# EAGLE design power-distro-board (EAGLE 9.2.0)
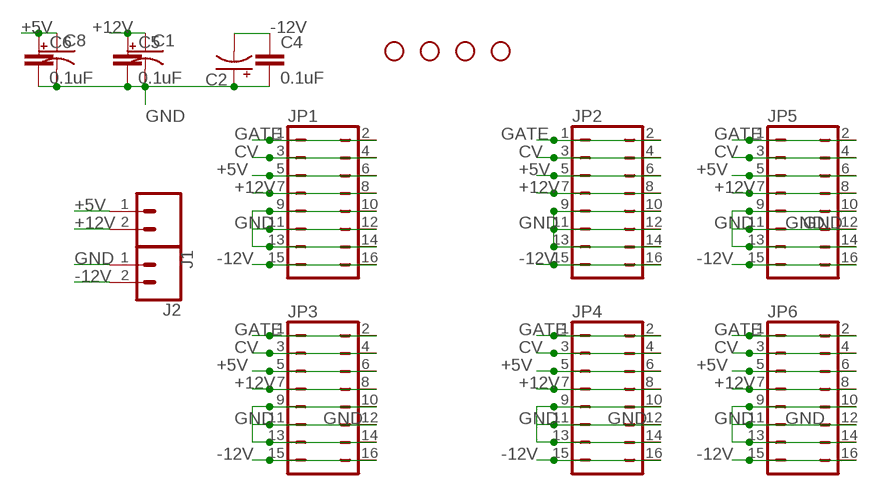
[diagram p0: schematic, sheet 1]

## Parts
C1  CPOL-USE2.5-6  [E2,5-6]
C2  CPOL-USE2.5-6  [E2,5-6]
C4  0.1uF  0.1UF-KIT-EZ-50V-20%  [CAP-PTH-SMALL-KIT]
C5  0.1uF  0.1UF-KIT-EZ-50V-20%  [CAP-PTH-SMALL-KIT]
C6  0.1uF  0.1UF-KIT-EZ-50V-20%  [CAP-PTH-SMALL-KIT]
C8  CPOL-USE2.5-6  [E2,5-6]
H1  STAND-OFF  [STAND-OFF]
H2  STAND-OFF  [STAND-OFF]
H3  STAND-OFF  [STAND-OFF]
H4  STAND-OFF  [STAND-OFF]
J1  CONN_023.5MM  [SCREWTERMINAL-3.5MM-2]
J2  CONN_023.5MM  [SCREWTERMINAL-3.5MM-2]
JP1  JP8Q  [JP8Q]
JP2  JP8Q  [JP8Q]
JP3  JP8Q  [JP8Q]
JP4  JP8Q  [JP8Q]
JP5  JP8Q  [JP8Q]
JP6  JP8Q  [JP8Q]

## Nets
+5V: C6.1 C8.+ J1.1 JP1.5 JP1.6 JP2.5 JP2.6 JP3.5 JP3.6 JP4.5 JP4.6 JP5.5 JP5.6 JP6.5 JP6.6
+12V: C1.+ C5.1 J1.2 JP1.7 JP1.8 JP2.7 JP2.8 JP3.7 JP3.8 JP4.7 JP4.8 JP5.7 JP5.8 JP6.7 JP6.8
-12V: C2.- C4.1 J2.2 JP1.15 JP1.16 JP2.15 JP2.16 JP3.15 JP3.16 JP4.15 JP4.16 JP5.15 JP5.16 JP6.15 JP6.16
CV: JP1.3 JP1.4 JP2.3 JP2.4 JP3.3 JP3.4 JP4.3 JP4.4 JP5.3 JP5.4 JP6.3 JP6.4
GATE: JP1.1 JP1.2 JP2.1 JP2.2 JP3.1 JP3.2 JP4.1 JP4.2 JP5.1 JP5.2 JP6.1 JP6.2
GND: C1.- C2.+ C4.2 C5.2 C6.2 C8.- J2.1 JP1.9 JP1.10 JP1.11 JP1.12 JP1.13 JP1.14 JP2.9 JP2.10 JP2.11 JP2.12 JP2.13 JP2.14 JP3.9 JP3.10 JP3.11 JP3.12 JP3.13 JP3.14 JP4.9 JP4.10 JP4.11 JP4.12 JP4.13 JP4.14 JP5.9 JP5.10 JP5.11 JP5.12 JP5.13 JP5.14 JP6.9 JP6.10 JP6.11 JP6.12 JP6.13 JP6.14

## Library data of the parts
C1 C2 C8 = rcl:CPOL-US: POLARIZED CAPACITOR, American symbol; SPICEPREFIX: C
C4-C6 = SparkFun-Capacitors:0.1UF: 0.1µF ceramic capacitors A capacitor is a passive two-terminal electrical component used to store electrical energy temporarily in an electric field.; PROD_ID: CAP-08370
H1-H4 = SparkFun-Hardware:STAND-OFF: Stand Off Drill holes for mechanically mounting via screws, standoffs, etc. Note: Use the keepout ring to avoid running the screw head into surrounding components. Variant Overviews STAND-OFF - Mechanical footprint for a #4 phillips button head screw. STAND-OFF-TIGHT - Mechanical footprint for a #4 phillips button head screw, Example SparkFun Products Screw - Phillips Head (1/4", 4-40, 10 pack) <https://www.sparkfun.com/products/10453> (PRT-10453) Screw - Phillips Head (1/2", 4-40, 10 pack) <https://www.sparkfun.com/products/10452> (PRT-10452) Screw - Phillips Head (3/4", 4-40, 10 pack) <https://www.sparkfun.com/products/10451> (PRT-10451) Screw - Phillips Head (1", 4-40, 10 pack) <https://www.sparkfun.com/products/10450> (PRT-10450)
J1 J2 = SparkFun-Connectors:CONN_02: Multi connection point. Often used as Generic Header-pin footprint for 0.1 inch spaced/style header connections On any of the 0.1 inch spaced packages, you can populate with these: Break Away Headers - Straight <https://www.sparkfun.com/products/116> (PRT-00116) Break Away Male Headers - Right Angle <https://www.sparkfun.com/products/553> (PRT-00553) Female Headers <https://www.sparkfun.com/products/115> (PRT-00115) Break Away Headers - Machine Pin <https://www.sparkfun.com/products/117> (PRT-00117) Break Away Female Headers - Swiss Machine Pin <https://www.sparkfun.com/products/743> (PRT-00743) For SCREWTERMINALS and SPRING TERMINALS visit here: Screw Terimnals on SparkFun.com <https://www.sparkfun.com/search/results?term=Screw+Terminals> (5mm/3.5mm/2.54mm spacing) This device is also useful as a general connection point to wire up your design to another part of your project. Our various solder wires solder well into these plated through hole pads. Hook-Up Wire - Assortment (Stranded, 22 AWG) <https://www.sparkfun.com/products/11375> (PRT-11375) Hook-Up Wire - Assortment (Solid Core, 22 AWG) <https://www.sparkfun.com/products/11367> (PRT-11367) View the entire wire category on our website here <https://www.sparkfun.com/categories/141> Special notes: Molex polarized connector foot print use with: PRT-08233 with associated crimp pins and housings. 2.54_SCREWTERM for use with PRT-10571. 3.5mm Screw Terminal footprints for PRT-08084 5mm Screw Terminal footprints for use with PRT-08432; PROD_ID: CONN-08399
JP1-JP6 = jumper:JP8Q: JUMPER

## Board
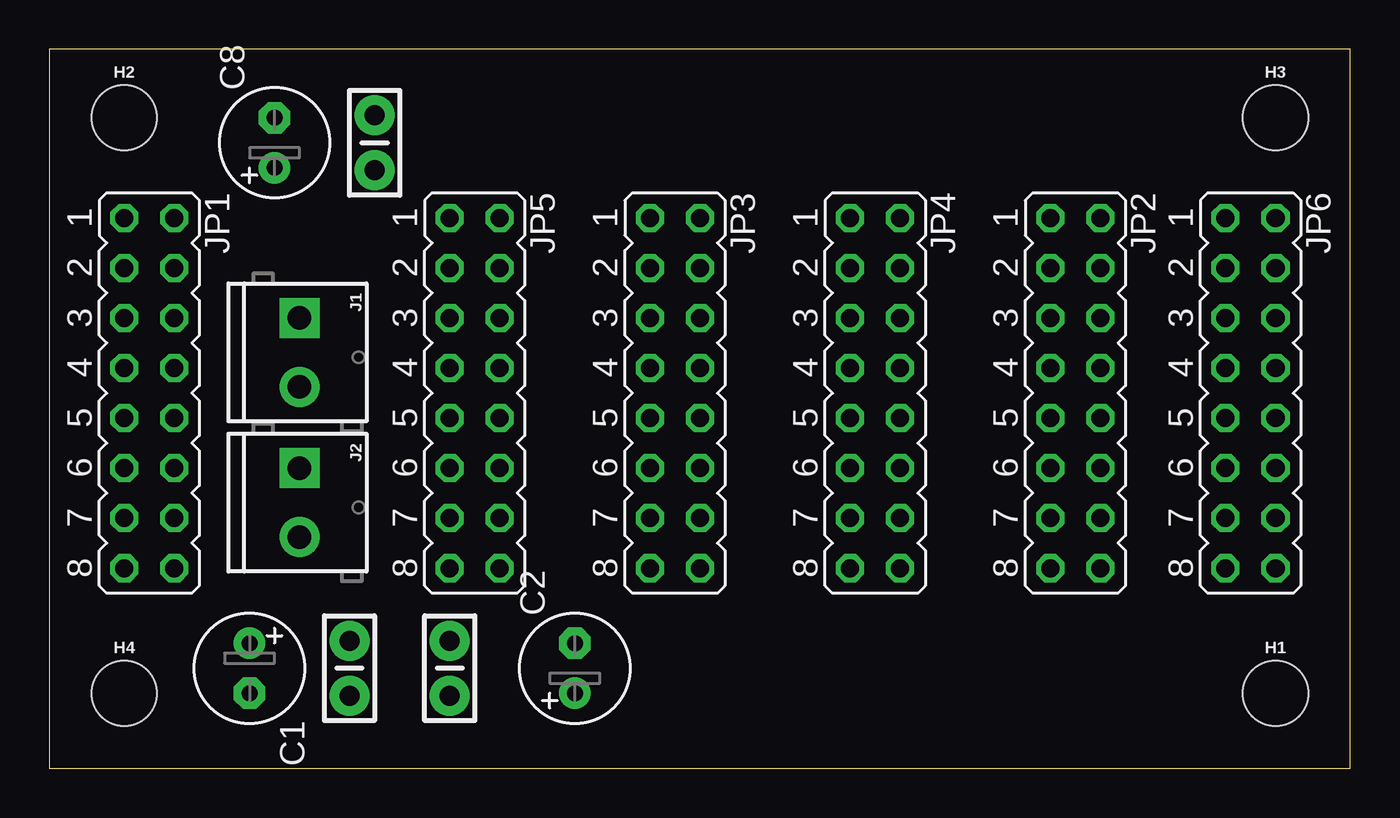
[diagram p1: board, top side]
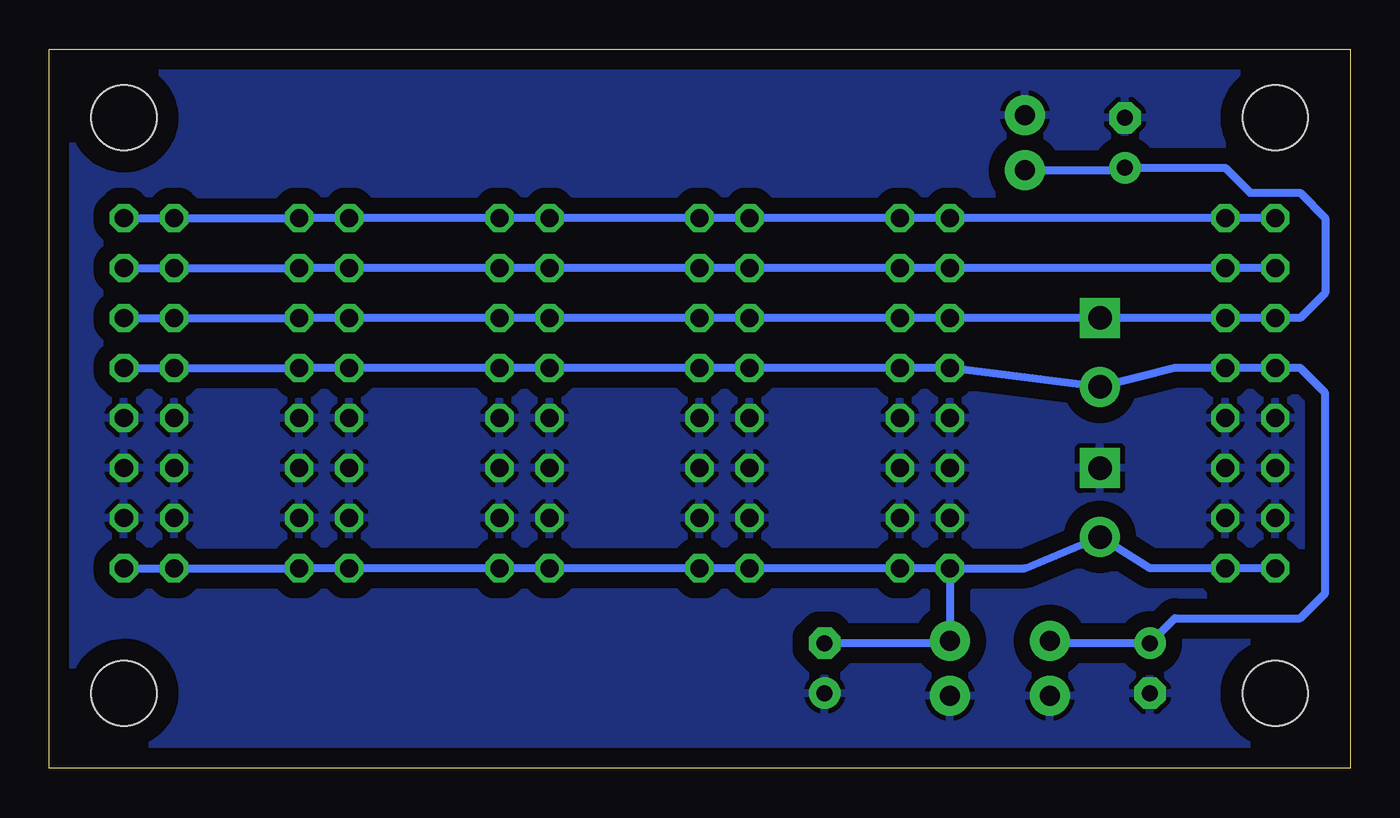
[diagram p2: board, bottom side, seen from below]

Size 66.02 x 36.5 mm. Coordinates in mm from the lower left corner, seen from the top.
Outline: 0,0 66.02,0 66.02,36.5 0,36.5 0,0
Copper layers (1*16): Top 0.035mm / dielectric 1.5mm / Bottom 0.035mm
Design rules "default": minimum track width 6mil, minimum drill 0.35mm, track to track 6mil, track to pad 6mil, pad to pad 6mil, via to via 6mil, smd to smd 6mil, copper to edge 40mil, drill to drill 6mil, minimum pad ring 10mil, minimum via ring 8mil, stop-mask expansion 4mil, vias tented up to drill 0mil, thermal gap 10mil

### Footprints (pad centres in the part's own frame; a part is rotated, then mirrored left to right if it is on the bottom)
E2,5-6 = drill 0.813 pad 1.6: + -1.27,0 | drill 0.813 pad 1.6 octagon: - 1.27,0
CAP-PTH-SMALL-KIT = drill 1.016 pad 2.032: 1 -1.397,0; 2 1.397,0
STAND-OFF = hole 3.302: 0,0
SCREWTERMINAL-3.5MM-2 = drill 1.2 pad 2.032 square: 1 0,0 | drill 1.2 pad 2.032: 2 3.5,0
JP8Q = drill 0.914 octagon: 1 -8.89,-1.27; 2 -8.89,1.27; 3 -6.35,-1.27; 4 -6.35,1.27; 5 -3.81,-1.27; 6 -3.81,1.27; 7 -1.27,-1.27; 8 -1.27,1.27; 9 1.27,-1.27; 10 1.27,1.27; 11 3.81,-1.27; 12 3.81,1.27; 13 6.35,-1.27; 14 6.35,1.27; 15 8.89,-1.27; 16 8.89,1.27

### Placement (x,y rotation side)
C1  10.16,5.08 270 top
C2  26.67,5.08 90 top
C4  20.32,5.08 270 top
C5  15.24,5.08 270 top
C6  16.51,31.75 90 top
C8  11.43,31.75 90 top
H1  62.23,3.81 0 top
H2  3.81,33.02 0 top
H3  62.23,33.02 0 top
H4  3.81,3.81 0 top
J1  12.7,22.86 270 top
J2  12.7,15.24 270 top
JP1  5.08,19.05 270 top
JP2  52.07,19.05 270 top
JP3  31.75,19.05 270 top
JP4  41.91,19.05 270 top
JP5  21.59,19.05 270 top
JP6  60.96,19.05 270 top

### Tracks (layer width: path | path; a pad name or v marks a point on that pad's centre or on a via)
+5V
  Bottom 0.406: JP6.6 JP6.5 JP2.6 JP2.5 JP4.6 JP4.5 JP3.6 JP3.5 JP5.6 JP5.5 J1.1 JP1.6 JP1.5 2.54,22.86 1.27,24.13 1.27,27.94 2.54,29.21 5.08,29.21 6.35,30.48 C8.+ 11.56,30.35 C6.1
+12V
  Bottom 0.406: JP6.8 JP6.7 JP2.8 JP2.7 JP4.8 JP4.7 JP3.8 JP3.7 JP5.8 JP5.7 J1.2 8.89,20.32 JP1.8 JP1.7 2.54,20.32 1.27,19.05 1.27,8.89 2.54,7.62 8.89,7.62 C1.+ 15.24,6.35 C5.1
-12V
  Bottom 0.406: JP1.15 JP1.16 10.16,10.16 J2.2 16.51,10.16 JP5.15 | JP5.15 JP5.16 JP3.15 JP3.16 JP4.15 JP4.16 JP2.15 JP2.16 JP6.15 JP6.16 | JP5.15 C4.1 | C4.1 20.32,6.35 | C4.1 20.45,6.35 C2.-
CV
  Bottom 0.406: JP1.3 JP1.4 JP5.3 JP5.4 JP3.3 JP3.4 JP4.3 JP4.4 JP2.3 JP2.4 JP6.3 JP6.4
GATE
  Bottom 0.406: JP1.1 JP1.2 JP5.1 JP5.2 JP3.1 JP3.2 JP4.1 JP4.2 JP2.1 JP2.2 JP6.1 JP6.2
GND
  pour Bottom (isolate 0.813): 0,0 0,36.83 66.04,36.83 66.04,0